# Altium schematic sheet FMC Memory.SchDoc: FMC Memory
size A4; Date: Not used; ApprovedBy: Not used; CheckedBy: Not used; Author: Not used; CompanyName: STMicroelectronics; DrawnBy: Not used; Engineer: Not used; Organization: Not used; Address1: Not used; Address2: Not used; Address3: Not used; Address4: Not used; DocumentNumber: Not used; Revision: Not used; SheetNumber: 7; SheetTotal: 22; CurrentTime: Not used; CurrentDate: Not used; Time: Not used; DocumentFullPathAndName: Not used; DocumentName: Not used; ModifiedDate: Not used; ImagePath: Not used; ProjectName: Not used; Application_BuildNumber: Not used
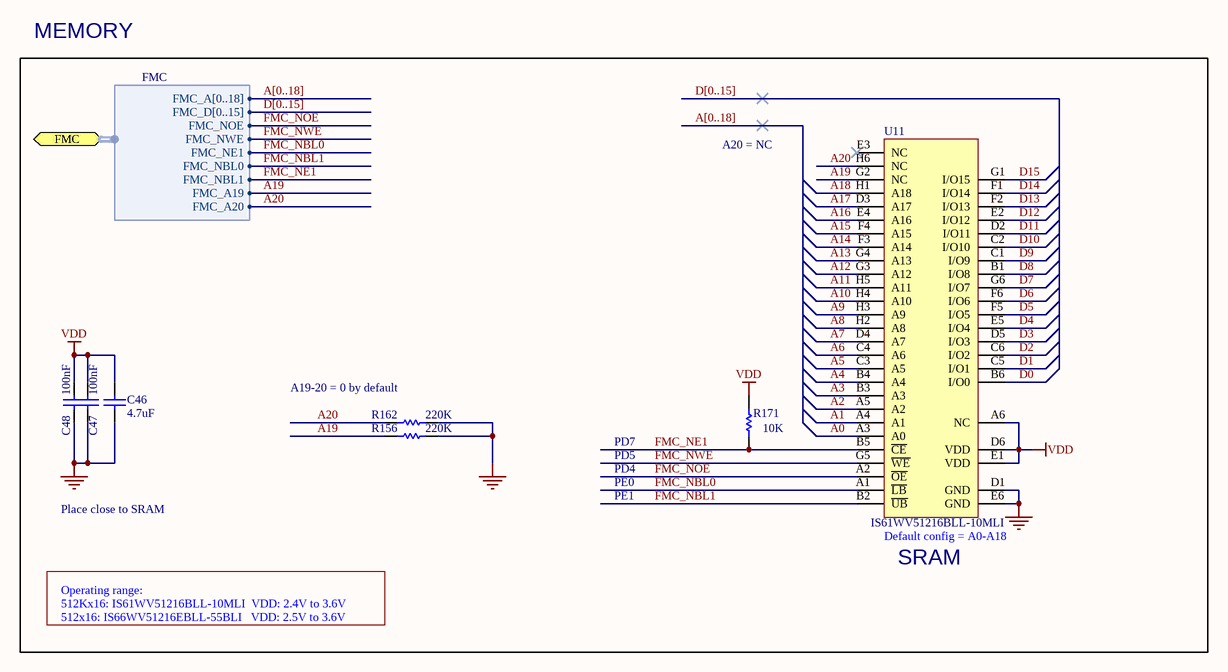
[diagram p0: FMC Memory.SchDoc]

## Parts
C46  value 4.7uF  [C0603]  (hidden comment: Capacitor)
C47  value 100nF  [C0402]  (hidden comment: Capacitor)
C48  value 100nF  [C0402]  (hidden comment: Capacitor)
R156  value 220K  [R0402]  (hidden comment: Resistor)
R162  value 220K  [R0402]  (hidden comment: Resistor)
R171  value 10K  [R0402]  (hidden comment: Resistor)
U11  IS61WV51216BLL-10MLI  [ICC_MINI-BGA48_9X11_P075]

## Ports
FMC (harness FMC)

## Harnesses
FMC: FMC_NWE, FMC_NOE, FMC_NE1, FMC_A[0..18], FMC_D[0..15], FMC_NBL0, FMC_NBL1, FMC_A19, FMC_A20

## Nets
GND: C46.1 C47.2 C48.2 R156.1 R162.1 U11.D1(GND) U11.E6(GND)
VDD: C46.2 C47.1 C48.1 R171.2 U11.A6(NC) U11.D6(VDD) U11.E1(VDD)
A0: U11.A3(A0)
A1: U11.A4(A1)
A2: U11.A5(A2)
A3: U11.B3(A3)
A4: U11.B4(A4)
A5: U11.C3(A5)
A6: U11.C4(A6)
A7: U11.D4(A7)
A8: U11.H2(A8)
A9: U11.H3(A9)
A10: U11.H4(A10)
A11: U11.H5(A11)
A12: U11.G3(A12)
A13: U11.G4(A13)
A14: U11.F3(A14)
A15: U11.F4(A15)
A16: U11.E4(A16)
A17: U11.D3(A17)
A18: U11.H1(A18)
A19: R156.2 U11.G2(NC) ; port FMC.FMC_A19
A20: R162.2 U11.H6(NC) ; port FMC.FMC_A20
D0: U11.B6(I/O0)
D1: U11.C5(I/O1)
D2: U11.C6(I/O2)
D3: U11.D5(I/O3)
D4: U11.E5(I/O4)
D5: U11.F5(I/O5)
D6: U11.F6(I/O6)
D7: U11.G6(I/O7)
D8: U11.B1(I/O8)
D9: U11.C1(I/O9)
D10: U11.C2(I/O10)
D11: U11.D2(I/O11)
D12: U11.E2(I/O12)
D13: U11.F2(I/O13)
D14: U11.F1(I/O14)
D15: U11.G1(I/O15)
FMC_NBL0: U11.A1(~{LB}) ; port FMC.FMC_NE1
FMC_NBL1: U11.B2(~{UB}) ; port FMC.FMC_NBL0
FMC_NE1: R171.1 U11.B5(~{CE}) ; port FMC.FMC_NBL1
FMC_NOE: U11.A2(~{OE}) ; port FMC.FMC_NOE
FMC_NWE: U11.G5(~{WE}) ; port FMC.FMC_NWE

Not connected (* = marked no-connect by the designer): U11 E3(NC)*

## Buses and harness runs
bus A[0..18]
bus D[0..15]

## Notes on the sheet
- MEMORY
- A20 = NC
- A19-20 = 0 by default
- PD5
- PD7
- Place close to SRAM
- PE1
- PE0
- PD4
- Operating range:
- (near U11) Default config = A0-A18
- (near U11) SRAM
- 512Kx16: IS61WV51216BLL-10MLI  VDD: 2.4V to 3.6V
- 512x16: IS66WV51216EBLL-55BLI   VDD: 2.5V to 3.6V
- Title:
- Project:
- Size:
- Revision:
- Variant:
- A4
- -
- Date:
- Reference:
- Sheet:
- of

## Library data of the parts
C46 = MCD-00009: Capacitor, MLCC, 4.7uF, 16V, X5R, 10%, 0603, T=0.8mm; Manufacturer_Part_Number: CC0603KRX5R7BB475; Manufacturer: YAGEO; Provided_By: SUBCO; Initial_Board_Reference: MB1274; Path: ws/MCD_ApplicationBoards/Lists/MCDPARTSdatabase; Item Type: Item; Internal_Part_Number: MCD-00009; Status: Released; Part_Type: Capacitor; Package: C0603; ComponentLink1Description: Datasheet; ComponentLink1URL: http://tunmcdsvn.tun.st.com/Component_Datasheet_Library/Trunk/Capacitors/Yageo_Multilayer_capacitor_X5R_series_100pF_to_100uF
C47 C48 = MCD-00006: Capacitor, MLCC, 100nF, 16V, X7R, 10%, 0402, T=0.5mm; Manufacturer_Part_Number: CC0402KRX7R7BB104; Manufacturer: YAGEO; Alternate_Manufacturer_Part_Number: GCM155R71C104KA55D; Alternate_Manufacturer: MURATA; Provided_By: SUBCO; Initial_Board_Reference: MB1274; Path: ws/MCD_ApplicationBoards/Lists/MCDPARTSdatabase; Item Type: Item; Internal_Part_Number: MCD-00006; ComponentLink1Description: Datasheet; Status: Released; Package: C0402; Part_Type: Capacitor; ComponentLink1URL: http://tunmcdsvn.tun.st.com/Component_Datasheet_Library/Trunk/Capacitors/Yageo_Multilayer_Capacitor_X7R_series_100pF_to_22uF
R156 R162 = MCD-00164: Resistor,220K,0402,1%,1/16W; Manufacturer_Part_Number: RC0402FR-07220KL; Manufacturer: YAGEO; Provided_By: SUBCO; Initial_Board_Reference: MB1264; Path: ws/MCD_ApplicationBoards/Lists/MCDPARTSdatabase; Item Type: Item; Internal_Part_Number: MCD-00164; Status: Checked; Part_Type: Resistor; ComponentLink1Description: Datasheet; Package: R0402; ComponentLink1URL: http://tunmcdsvn.tun.st.com/Component_Datasheet_Library/Trunk/Resistors/Yageo_Resistor_RC0402-series
R171 = MCD-00053: Resistor,10K,0402,1%,1/16W; Manufacturer_Part_Number: RC0402FR-0710KL; Manufacturer: YAGEO; Provided_By: SUBCO; Initial_Board_Reference: MB1274; Path: ws/MCD_ApplicationBoards/Lists/MCDPARTSdatabase; Item Type: Item; Internal_Part_Number: MCD-00053; ComponentLink1Description: Datasheet; Status: Released; Part_Type: Resistor; Package: R0402; ComponentLink1URL: http://tunmcdsvn.tun.st.com/Component_Datasheet_Library/Trunk/Resistors/Yageo_Resistor_RC0402-series
U11 = MCD-01071: SRAM, 8Mb, 10ns, 512Kx16bits, Async, 3.3v; Manufacturer: ISSI; Part_Type: IC; Provided_By: SUBCO; Initial_Board_Reference: MB1361; Path: ws/MCD_ApplicationBoards/Lists/MCDPARTSdatabase; Item Type: Item; Internal_Part_Number: MCD-01071; Value: IS61WV51216BLL-10MLI; Status: Checked; Manufacturer_Part_Number: IS61WV51216BLL-10MLI; ComponentLink1Description: Datasheet; ComponentLink1URL: http://tunmcdsvn.tun.st.com/Component_Datasheet_Library/Trunk/IC/ISSI_IS61WV51216BLL-10MLI; Package: miniBGA 48 9x11